# Altium schematic sheet main.SchDoc
size 381 x 241 mm; SheetNumber: 1; SheetTotal: 13
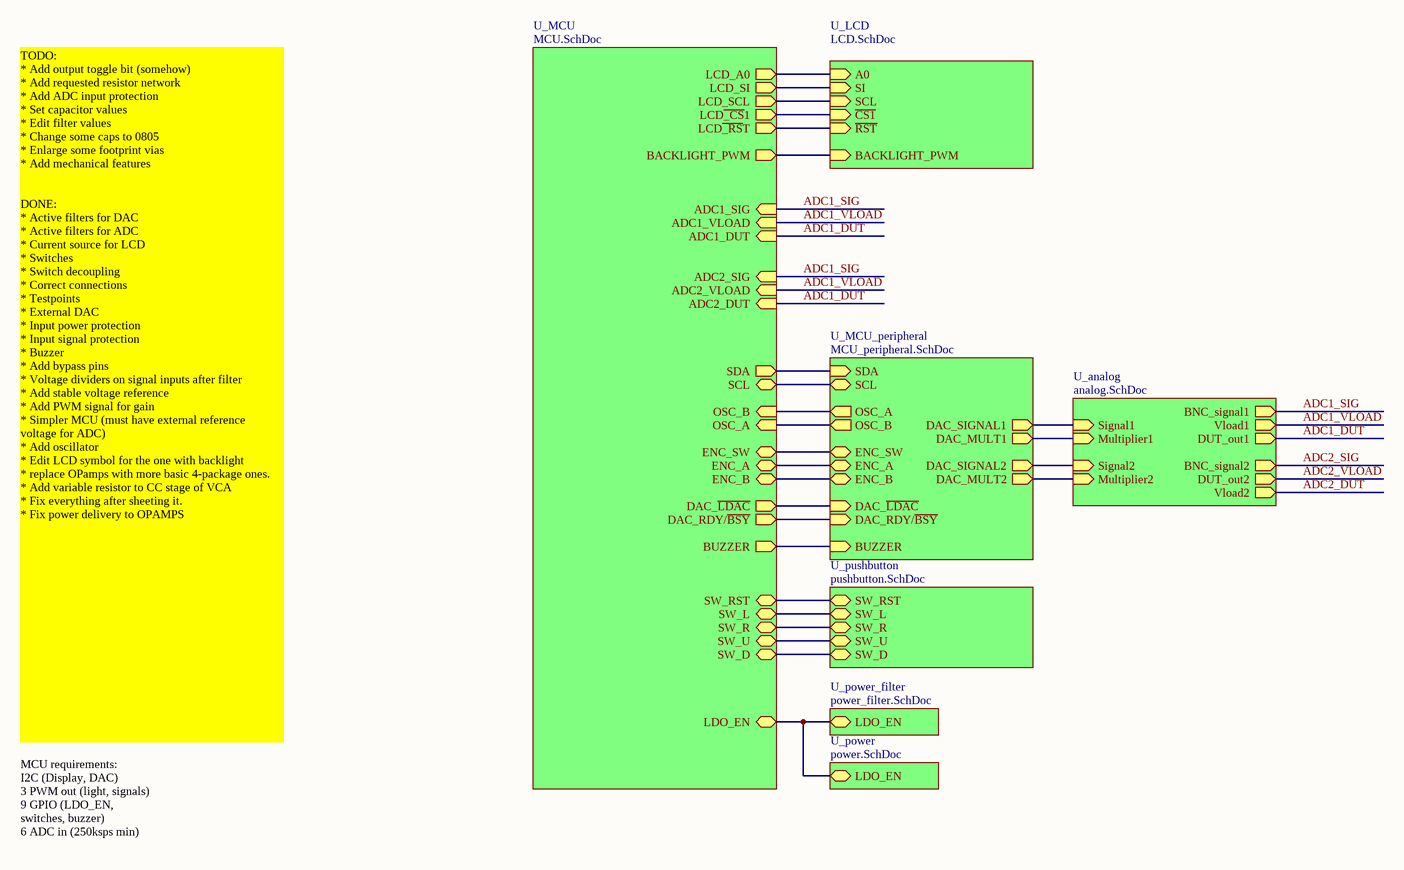
[diagram p0: main.SchDoc]

## Sub-sheets
U_analog = analog.SchDoc: Signal1 (in), Multiplier1 (in), Signal2 (in), Multiplier2 (in), BNC_signal1 (out), Vload1 (out), DUT_out1 (out), DUT_out2 (out), Vload2 (out), BNC_signal2 (out)
U_LCD = LCD.SchDoc: BACKLIGHT_PWM (in), A0 (in), SI (in), SCL (in), ~{CS1} (in), ~{RST} (in)
U_MCU = MCU.SchDoc: OSC_A (in), OSC_B (in), SDA (out), SCL (bidir), LCD_A0 (out), LCD_SI (out), LCD_SCL (out), LCD~{_CS}1 (out), LCD~{_RS}T (out), BUZZER (out), LDO_EN (bidir), BACKLIGHT_PWM (out), SW_U (bidir), SW_D (bidir), SW_L (bidir), SW_R (bidir), ENC_SW (bidir), ENC_A (bidir), ENC_B (bidir), DAC_~{LDAC} (out), DAC_RDY/~{BSY} (out), SW_RST (bidir), ADC1_SIG (in), ADC1_VLOAD (in), ADC1_DUT (in), ADC2_SIG (in), ADC2_VLOAD (in), ADC2_DUT (in)
U_MCU_peripheral = MCU_peripheral.SchDoc: ENC_SW (bidir), ENC_A (bidir), ENC_B (bidir), OSC_A (out), OSC_B (out), SDA (in), SCL (bidir), DAC_~{LDAC} (in), DAC_RDY/~{BSY} (in), BUZZER (in), DAC_SIGNAL1 (out), DAC_MULT1 (out), DAC_SIGNAL2 (out), DAC_MULT2 (out)
U_power = power.SchDoc: LDO_EN (bidir)
U_power_filter = power_filter.SchDoc: LDO_EN (bidir)
U_pushbutton = pushbutton.SchDoc: SW_RST (bidir), SW_L (bidir), SW_R (bidir), SW_U (bidir), SW_D (bidir)

## Nets
ADC1_DUT: sheet U_MCU/ADC1_DUT, sheet U_MCU/ADC2_DUT, sheet U_analog/DUT_out1
ADC1_SIG: sheet U_MCU/ADC1_SIG, sheet U_MCU/ADC2_SIG, sheet U_analog/BNC_signal1
ADC1_VLOAD: sheet U_MCU/ADC1_VLOAD, sheet U_MCU/ADC2_VLOAD, sheet U_analog/Vload1
ADC2_DUT: sheet U_analog/Vload2
ADC2_SIG: sheet U_analog/BNC_signal2
ADC2_VLOAD: sheet U_analog/DUT_out2
(unnamed): sheet U_pushbutton/SW_RST, sheet U_MCU/SW_RST
(unnamed): sheet U_pushbutton/SW_L, sheet U_MCU/SW_L
(unnamed): sheet U_pushbutton/SW_R, sheet U_MCU/SW_R
(unnamed): sheet U_pushbutton/SW_U, sheet U_MCU/SW_U
(unnamed): sheet U_pushbutton/SW_D, sheet U_MCU/SW_D
(unnamed): sheet U_MCU/OSC_A, sheet U_MCU_peripheral/OSC_B
(unnamed): sheet U_MCU/OSC_B, sheet U_MCU_peripheral/OSC_A
(unnamed): sheet U_MCU/SDA, sheet U_MCU_peripheral/SDA
(unnamed): sheet U_MCU/SCL, sheet U_MCU_peripheral/SCL
(unnamed): sheet U_MCU/LCD_A0, sheet U_LCD/A0
(unnamed): sheet U_MCU/LCD_SI, sheet U_LCD/SI
(unnamed): sheet U_MCU/LCD_SCL, sheet U_LCD/SCL
(unnamed): sheet U_MCU/LCD~{_CS}1, sheet U_LCD/~{CS1}
(unnamed): sheet U_MCU/LCD~{_RS}T, sheet U_LCD/~{RST}
(unnamed): sheet U_MCU/BUZZER, sheet U_MCU_peripheral/BUZZER
(unnamed): sheet U_MCU/LDO_EN, sheet U_power_filter/LDO_EN, sheet U_power/LDO_EN
(unnamed): sheet U_MCU/BACKLIGHT_PWM, sheet U_LCD/BACKLIGHT_PWM
(unnamed): sheet U_MCU/ENC_SW, sheet U_MCU_peripheral/ENC_SW
(unnamed): sheet U_MCU/ENC_A, sheet U_MCU_peripheral/ENC_A
(unnamed): sheet U_MCU/ENC_B, sheet U_MCU_peripheral/ENC_B
(unnamed): sheet U_MCU/DAC_~{LDAC}, sheet U_MCU_peripheral/DAC_~{LDAC}
(unnamed): sheet U_MCU/DAC_RDY/~{BSY}, sheet U_MCU_peripheral/DAC_RDY/~{BSY}
(unnamed): sheet U_MCU_peripheral/DAC_SIGNAL1, sheet U_analog/Signal1
(unnamed): sheet U_MCU_peripheral/DAC_MULT1, sheet U_analog/Multiplier1
(unnamed): sheet U_MCU_peripheral/DAC_SIGNAL2, sheet U_analog/Signal2
(unnamed): sheet U_MCU_peripheral/DAC_MULT2, sheet U_analog/Multiplier2

## Notes on the sheet
- TODO:
  * Add output toggle bit (somehow)
  * Add requested resistor network
  * Add ADC input protection
  * Set capacitor values
  * Edit filter values
  * Change some caps to 0805
  * Enlarge some footprint vias
  * Add mechanical features
  DONE:
  * Active filters for DAC
  * Active filters for ADC
  * Current source for LCD
  * Switches
  * Switch decoupling
  * Correct connections
  * Testpoints
  * External DAC
  * Input power protection
  * Input signal protection
  * Buzzer
  * Add bypass pins
  * Voltage dividers on signal inputs after filter
  * Add stable voltage reference
  * Add PWM signal for gain
  * Simpler MCU (must have external reference  voltage for ADC)
  * Add oscillator
  * Edit LCD symbol for the one with backlight
  * replace OPamps with more basic 4-package ones.
  * Add variable resistor to CC stage of VCA
  * Fix everything after sheeting it.
  * Fix power delivery to OPAMPS
- MCU requirements:
  I2C (Display, DAC)
  3 PWM out (light, signals)
  9 GPIO (LDO_EN, switches, buzzer)
  6 ADC in (250ksps min)